# EAGLE design Le-Board (EAGLE 6.1)
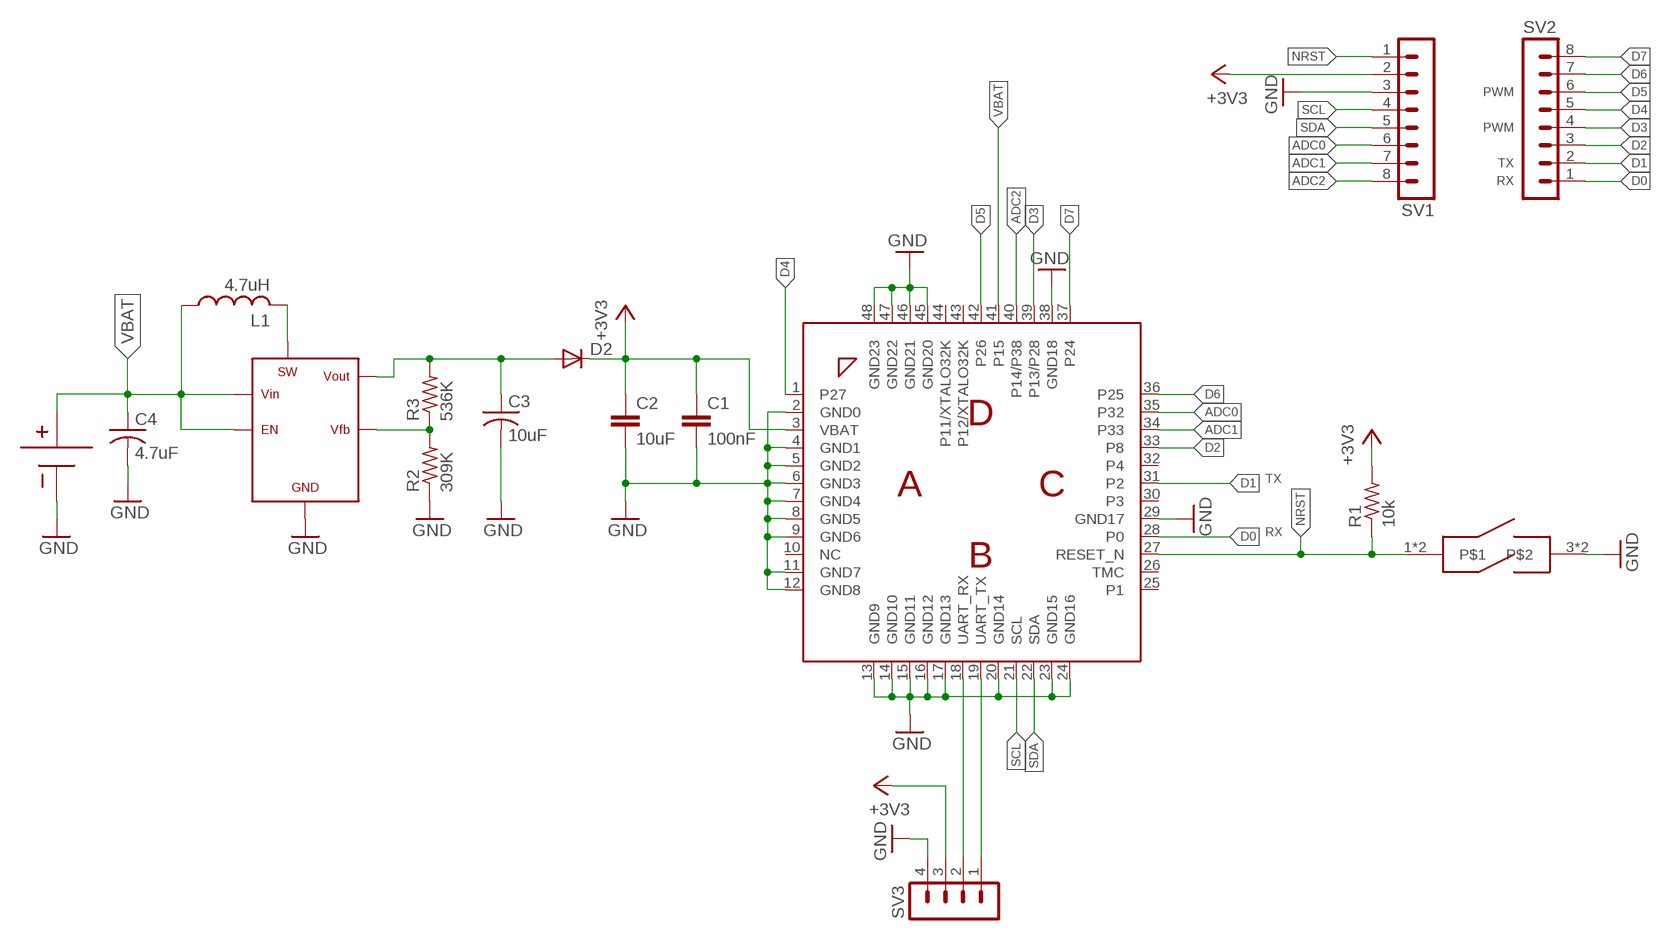
[diagram p0: schematic, sheet 1]

## Parts
C1  100nF  C-EUC0603  [C0603]
C2  10uF  C-EUC0603  [C0603]
C3  10uF  C-USC0603  [C0603]
C4  4.7uF  C-USC0603  [C0603]
D2  DIODE-DO214AA  [DO214AA]
L1  4.7uH  L-USL2825P  [L2825P]
R1  10k  R-US_R0603  [R0603]
R2  309K  R-US_R0603  [R0603]
R3  536K  R-US_R0603  [R0603]
SV1  MA08-1  [MA08-1]
SV2  MA08-1  [MA08-1]
SV3  MA04-1  [MA04-1]
U$1  BCM20732S  [LGA-48]
U$5  ELEVATOR  [ELEVATOR]
U$10  FSM4JSMA  [FSM4JSMA]
U$17  CR2032_HLD  [CR2031_BAT_HLD]

## Nets
+3V3: C1.1 C2.1 D2.C R1.2 SV1.2 SV3.3 U$1.3(VBAT)
ADC0: SV1.6 U$1.35(P32)
ADC1: SV1.7 U$1.34(P33)
ADC2: SV1.8 U$1.40(P14/P38)
D0: SV2.1 U$1.28(P0)
D1: SV2.2 U$1.31(P2)
D2: SV2.3 U$1.33(P8)
D3: SV2.4 U$1.39(P13/P28)
D4: SV2.5 U$1.1(P27)
D5: SV2.6 U$1.42(P26)
D6: SV2.7 U$1.36(P25)
D7: SV2.8 U$1.37(P24)
GND: C1.2 C2.2 C3.2 C4.2 R2.1 SV1.3 SV3.4 U$1.2(GND0) U$1.4(GND1) U$1.5(GND2) U$1.6(GND3) U$1.7(GND4) U$1.8(GND5) U$1.9(GND6) U$1.11(GND7) U$1.12(GND8) U$1.13(GND9) U$1.14(GND10) U$1.15(GND11) U$1.16(GND12) U$1.17(GND13) U$1.20(GND14) U$1.23(GND15) U$1.24(GND16) U$1.29(GND17) U$1.38(GND18) U$1.45(GND20) U$1.46(GND21) U$1.47(GND22) U$1.48(GND23) U$5.2(GND) U$10.3 U$10.4 U$17.BOT(-)
HCI_RX: SV3.2 U$1.18(UART_RX)
HCI_TX: SV3.1 U$1.19(UART_TX)
N$3: C3.1 D2.A R3.2 U$5.5(VOUT)
N$4: R2.2 R3.1 U$5.4(VFB)
N$5: L1.2 U$5.1(SW)
NRST: R1.1 SV1.1 U$1.27(RESET_N) U$10.1 U$10.2
SCL: SV1.4 U$1.21(SCL)
SDA: SV1.5 U$1.22(SDA)
VBAT: C4.1 L1.1 U$1.41(P15) U$5.3(EN) U$5.6(VIN) U$17.TOP1(+) U$17.TOP2(+)
Unconnected: U$1.10(NC) U$1.25(P1) U$1.26(TMC) U$1.30(P3) U$1.32(P4) U$1.43(P12/XTALO32K) U$1.44(P11/XTALO32K)

## Notes on the sheet
- PWM
- PWM
- TX
- RX
- TX
- RX

## Library data of the parts
C1 C2 = resistor:C-EU: CAPACITOR, European symbol
C3 C4 = resistor:C-US: CAPACITOR, American symbol
D2 = diode:DIODE-: DIODE
L1 = resistor:L-US: INDUCTOR, American symbol
R1-R3 = resistor:R-US_: RESISTOR, American symbol
SV1 SV2 = con-lstb:MA08-1: PIN HEADER; OC_FARNELL: unknown; OC_NEWARK: unknown
SV3 = con-lstb:MA04-1: PIN HEADER; OC_FARNELL: unknown; OC_NEWARK: unknown
U$1 = BCM20732S:BCM20732S
U$5 = domo-elv:ELEVATOR
U$10 = button:FSM4JSMA
U$17 = bat-hld:CR2032_HLD

## Board
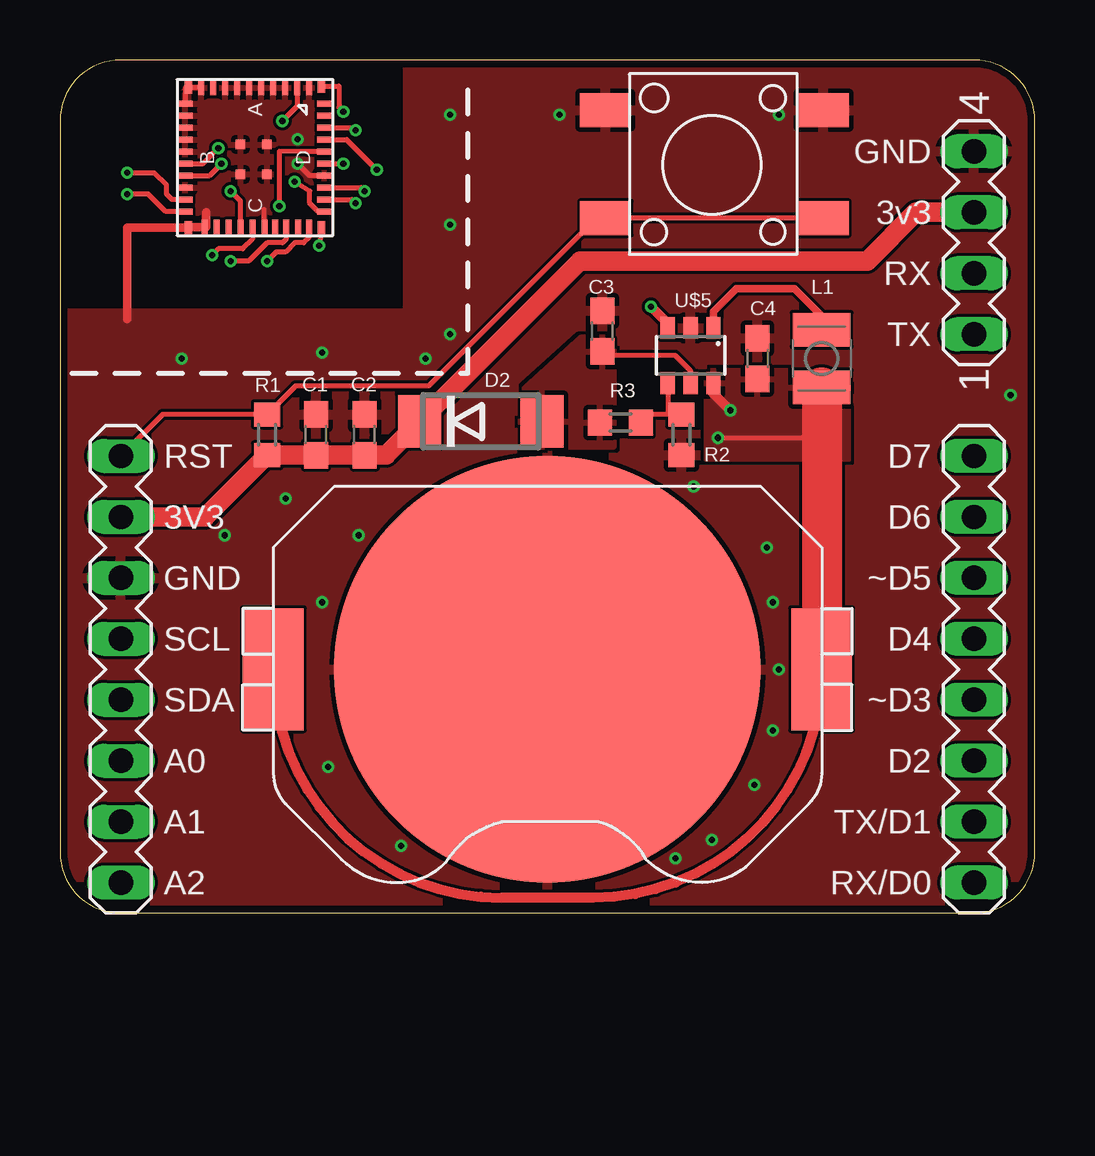
[diagram p1: board, top side]
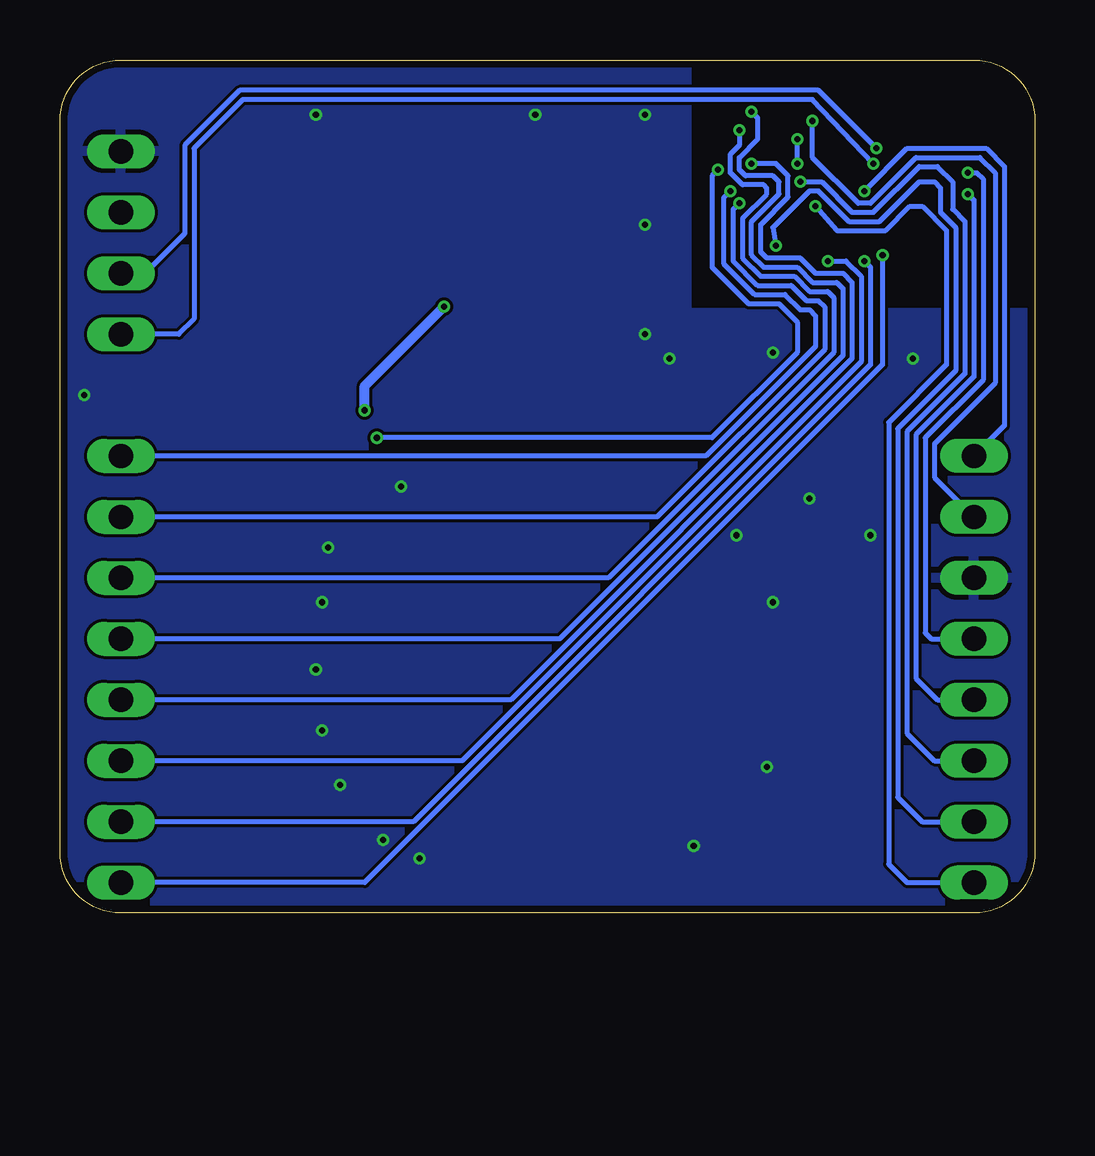
[diagram p2: board, bottom side, seen from below]

Size 40.64 x 35.56 mm. Coordinates in mm from the lower left corner, seen from the top.
Outline: 0,33.02 0,2.54 arc90 2.54,0 38.1,0 arc90 40.64,2.54 40.64,33.02 arc90 38.1,35.56 2.54,35.56 arc90 0,33.02
Copper layers (1*16): Top 0.035mm / dielectric 1.5mm / Bottom 0.035mm
Design rules: minimum track width 0.125mm, minimum drill 0.2mm, track to track 0.125mm, track to pad 0.125mm, pad to pad 0.125mm, via to via 0.125mm, smd to smd 0.125mm, copper to edge 0.3mm, drill to drill 0.2mm, minimum pad ring 0.2mm, minimum via ring 0.125mm, stop-mask expansion 0.075mm, vias tented up to drill 0mil, thermal gap 0.2mm

### Footprints (pad centres in the part's own frame; a part is rotated, then mirrored left to right if it is on the bottom)
C0603 = smd 1.1 x 1: 1 -0.85,0; 2 0.85,0
DO214AA = smd 1.8 x 2.2: A 2.55,0; C -2.55,0
L2825P = smd 1.4 x 2.4: 1 -1.2,0; 2 1.2,0
R0603 = smd 1 x 1.1: 1 -0.85,0; 2 0.85,0
MA08-1 = drill 1.016 long: 1 -8.89,0; 2 -6.35,0; 3 -3.81,0; 4 -1.27,0; 5 1.27,0; 6 3.81,0; 7 6.35,0; 8 8.89,0
MA04-1 = drill 1.016 long: 1 -3.81,0; 2 -1.27,0; 3 1.27,0; 4 3.81,0
LGA-48 = smd 0.55 x 0.3: 1 -2.975,2.77; 12 -2.925,-2.77; 23 2.925,-2.77; 34 2.925,2.77 | smd 0.6 x 0.25: 2 -2.9,2.25; 3 -2.9,1.75; 4 -2.9,1.25; 5 -2.9,0.75; 6 -2.9,0.25; 7 -2.9,-0.25; 8 -2.9,-0.75; 9 -2.9,-1.25; 10 -2.9,-1.75; 11 -2.9,-2.25; 24 2.9,-2.1; 25 2.9,-1.6; 26 2.9,-1.1; 27 2.9,-0.6; 28 2.9,-0.1; 29 2.9,0.4; 30 2.9,0.85; 31 2.9,1.3; 32 2.9,1.8; 33 2.9,2.25 | smd 0.25 x 0.6: 13 -2.25,-2.9; 14 -1.75,-2.9; 15 -1.25,-2.9; 16 -0.75,-2.9; 17 -0.25,-2.9; 18 0.25,-2.9; 19 0.75,-2.9; 20 1.25,-2.9; 21 1.75,-2.9; 22 2.25,-2.9; 35 2.25,2.9; 36 1.75,2.9; 37 1.25,2.9; 38 0.75,2.9; 39 0.25,2.9; 40 -0.25,2.9; 41 -0.75,2.9; 42 -1.25,2.9; 43 -1.75,2.9; 44 -2.25,2.9 | smd 0.4 x 0.4: 45 -0.54,0.5; 46 -0.54,-0.6; 47 0.7,-0.6; 48 0.7,0.5
ELEVATOR = smd 0.6 x 0.9: 1 -0.95,-1.15; 2 0,-1.15; 3 0.95,-1.15; 4 0.95,1.15; 5 0,1.15; 6 -0.95,1.15
FSM4JSMA = smd 1.4 x 2.1: 1 2.277,4.655; 2 2.277,-4.445; 3 -2.223,4.655; 4 -2.223,-4.445
CR2031_BAT_HLD = smd 17.78 x 17.78: BOT 0,0 | smd 2.54 x 5.08: TOP1 -11.43,0; TOP2 11.43,0

### Placement (x,y rotation side)
C1  10.67,19.94 90 top
C2  12.7,19.94 90 top
C3  22.61,24.26 90 top
C4  29.08,23.11 90 top
D2  17.54,20.5 0 top
L1  31.75,23.11 90 top
R1  8.64,19.94 270 top
R2  25.91,19.94 90 top
R3  23.37,20.45 180 top
SV1  2.54,10.16 270 top
SV2  38.1,10.16 90 top
SV3  38.1,27.94 90 top
U$1  8.13,31.5 270 top
U$5  26.29,23.24 180 top
U$10  27.18,31.24 270 top
U$17  20.32,10.16 0 top

### Tracks (layer width: path | path; a pad name or v marks a point on that pad's centre or on a via)
+3V3  (via drill 0.25)
  Top 0.203: U$1.3 9.88,33.63 v9.27,33.02
  Top 0.813: SV3.3 35.69,29.21 33.66,27.18 21.68,27.18 D2.C 13.59,19.09 C2.1 C1.1 R1.2 6.06,16.51 SV1.2
  Bottom 0.203: SV1.2 4.19,18.16 4.19,19.56 1.65,22.1 1.65,30.86 2.29,31.5 4.95,31.5 6.86,29.59 7.37,29.59 9.27,31.5 v9.27,33.02
ADC0  (via drill 0.25)
  Top 0.203: U$1.35 10.76,29.25 10.41,29.59 10.41,30.1 v9.78,30.48
  Bottom 0.203: SV1.6 4.19,6.35 5.33,7.49 5.33,20.07 2.92,22.48 2.92,28.83 3.43,29.34 3.43,30.48 4.06,31.11 4.83,31.11 6.73,29.21 7.62,29.21 8.89,30.48 v9.78,30.48
ADC1  (via drill 0.25)
  Top 0.203: U$1.34 10.93,28.57 v10.79,27.81
  Bottom 0.203: SV1.7 4.7,3.81 5.71,4.83 5.71,20.19 3.3,22.61 3.3,28.57 3.94,29.21 3.94,30.23 4.19,30.48 4.83,30.48 6.48,28.83 7.75,28.83 9.02,30.1 9.4,30.1 10.92,28.57 v10.79,27.81
ADC2  (via drill 0.25)
  Top 0.203: U$1.40 10.28,31.75 9.14,31.75 v9.14,29.46
  Bottom 0.203: v9.14,29.46 8.26,28.45 6.22,28.45 5.21,29.46 4.7,29.46 3.68,28.45 3.68,22.86 6.1,20.45 6.1,2.03 5.33,1.27 SV1.8
D0  (via drill 0.25)
  Top 0.203: U$1.28 8.03,28.09 7.62,27.69 6.6,27.69 v6.35,27.43
  Bottom 0.203: v6.35,27.43 6.35,22.86 27.94,1.27 SV2.1
D1  (via drill 0.25)
  Top 0.203: U$1.31 9.43,28.1 9.27,27.94 8.64,27.94 7.87,27.18 v7.11,27.18
  Bottom 0.203: v7.11,27.18 6.86,26.92 6.86,22.86 25.91,3.81 SV2.2
D2  (via drill 0.25)
  Top 0.203: U$1.33 10.38,28.16 10.16,27.94 9.78,27.94 9.4,27.56 9.02,27.56 v8.64,27.18
  Bottom 0.203: v8.64,27.18 7.87,27.18 7.24,26.54 7.24,22.99 23.88,6.35 SV2.3
D3  (via drill 0.25)
  Top 0.203: U$1.39 11.68,31.25 v11.81,31.24
  Bottom 0.203: SV2.4 21.84,8.89 7.62,23.11 7.62,26.29 8,26.67 9.14,26.67 9.78,27.3 11.18,27.3 11.43,27.56 11.43,28.7 10.29,29.84 10.29,30.73 10.79,31.24 v11.81,31.24
D4  (via drill 0.25)
  Top 0.203: U$1.1 11.63,34.47 11.63,33.58 v11.81,33.4
  Bottom 0.203: SV2.5 19.81,11.43 8,23.24 8,26.04 8.26,26.29 9.27,26.29 9.91,26.92 11.3,26.92 11.81,27.43 11.81,28.83 10.67,29.97 10.67,30.48 10.92,30.73 12.06,30.73 12.32,30.99 12.32,31.5 11.56,32.26 11.56,33.15 v11.81,33.4
D5  (via drill 0.25)
  Top 0.203: U$1.42 12.21,32.75 v12.32,32.64
  Bottom 0.203: v12.32,32.64 12.32,32 12.7,31.62 12.7,30.86 12.19,30.35 11.3,30.35 11.18,30.23 11.18,29.97 12.19,28.96 12.19,27.3 11.43,26.54 10.03,26.54 9.4,25.91 8.64,25.91 8.38,25.65 8.38,23.37 17.78,13.97 SV2.6
D6  (via drill 0.25)
  Top 0.203: U$1.36 12.16,29.75 v12.32,29.59
  Bottom 0.203: SV2.7 15.75,16.51 8.76,23.5 8.76,25.27 9.02,25.53 9.53,25.53 10.16,26.16 11.56,26.16 12.57,27.18 12.57,29.34 v12.32,29.59
D7  (via drill 0.25)
  Top 0.203: U$1.37 12.55,30.25 v12.7,30.1
  Bottom 0.203: SV2.8 13.72,19.05 9.14,23.62 9.14,24.89 9.4,25.15 9.78,25.15 10.41,25.78 11.68,25.78 12.95,27.05 12.95,29.84 v12.7,30.1
GND  (via drill 0.25)
  Top 0.203: U$1.13 5.23,34.42 U$1.12 5.36,34.4 U$1.11 | U$1.24 6.1,28.6 | 5.36,28.6 U$1.23 | U$1.29 8.51,28.6 8.51,29.34 | U$1.38 10.4,30.75 v9.91,31.24 | v9.91,32.26 9.91,32.38
  Top 0.356: 6.1,28.6 6.1,29.21 | U$1.24 5.36,28.6 | U$1.23 2.79,28.57 2.79,24.77
  Bottom 0.203: v9.91,31.24 v9.91,32.26
  other vias: 16.26,33.27 16.26,24.13 16.26,28.7 15.24,23.11 10.92,23.37 5.08,23.11 9.4,17.27 6.86,15.75 12.45,15.75 10.92,12.95 11.18,6.1 14.22,2.79 25.65,2.29 27.18,3.05 28.96,5.33 29.72,7.62 29.97,10.16 29.72,12.95 29.46,15.24 26.42,17.78 39.62,21.59 20.83,33.27 29.97,33.27
  pour Bottom: -0.5,25 14.5,25 14.5,36 41,36 41,-0.5 -0.5,-0.5
  pour Top (rank 2): -0.5,25 14.5,25 14.5,36 41,36 41,-0.5 -0.5,-0.5
  pour Top: 5,29 5,34.11 5.39,34.5 11,34.5 11,29
HCI_RX  (via drill 0.25)
  Top 0.203: U$1.18 5.97,31.25 v6.6,31.88
  Bottom 0.203: v6.6,31.88 9.02,34.29 33.15,34.29 35.43,32 35.43,28.32 37.08,26.67 SV3.2
HCI_TX  (via drill 0.25)
  Top 0.203: U$1.19 6.24,30.75 v6.73,31.24
  Bottom 0.203: v6.73,31.24 9.27,33.91 33.02,33.91 35.05,31.88 35.05,24.77 35.69,24.13 SV3.1
N$3
  Top 0.203: U$5.5 26.29,22.61 25.65,23.24 22.77,23.24 C3.1
  pour Top: 19.18,19.43 23.11,19.43 23.11,24 21.72,24 19.18,21.72
N$4
  Top 0.203: R2.2 25.4,20.79 | 25.4,20.79 24.56,20.79 R3.1 | U$5.4 25.34,20.85 25.4,20.79
N$5
  Top 0.305: L1.2 31.75,24.89 30.61,26.04 28.19,26.04 27.24,25.08 U$5.1
NRST  (via drill 0.25)
  Top 0.203: U$1.27 7.53,29.68 v7.11,30.1 | SV1.1 4.28,20.79 R1.1 9.82,21.97 15.37,21.97 22.36,28.96 U$10.2 U$10.1
  Bottom 0.203: v7.11,30.1 5.33,31.88 2.03,31.88 1.27,31.11 1.27,20.32 SV1.1
SCL  (via drill 0.25)
  Top 0.203: U$1.21 4.67,29.75 4.45,29.97 4.45,30.35 3.94,30.86 v2.79,30.86
  Bottom 0.203: v2.79,30.86 2.41,30.86 2.16,30.61 2.16,22.23 4.57,19.81 4.57,11.68 4.32,11.43 SV1.4
SDA  (via drill 0.25)
  Top 0.203: U$1.22 4.41,29.25 3.68,29.97 v2.79,29.97
  Bottom 0.203: v2.79,29.97 2.54,29.72 2.54,22.35 4.95,19.94 4.95,9.78 4.06,8.89 SV1.5
VBAT  (via drill 0.25)
  Top 0.203: U$1.41 11.95,32.25 v13.21,30.99 | v27.43,19.81 31.75,19.81
  Top 0.406: U$5.6 27.24,21.66 v27.94,20.95 | 24.64,25.22 v24.64,25.27 25.34,24.57 U$5.3 | U$17.TOP1 arc90 18.41,0.64 22.23,0.64 arc90 U$17.TOP2
  Top 1.676: L1.1 31.75,19.81 U$17.TOP2
  Bottom 0.203: v13.21,30.99 13.46,30.73 13.46,26.92 11.94,25.4 10.67,25.4 9.91,24.64 9.91,23.37 13.46,19.81 v27.43,19.81
  Bottom 0.406: v27.94,20.95 27.94,21.97 v24.64,25.27
  pour Top: 32.89,22.61 26.92,22.61 26.92,18.92 32.89,18.92

### Text on the board
tPlace: GND | 3v3 | RX | TX | RST | D7 | 3V3 | D6 | GND | ~D5 | SCL | D4 | SDA | ~D3 | A0 | D2 | A1 | TX/D1 | A2 | RX/D0